# EAGLE design MESH-Grove (EAGLE 7.5.0)
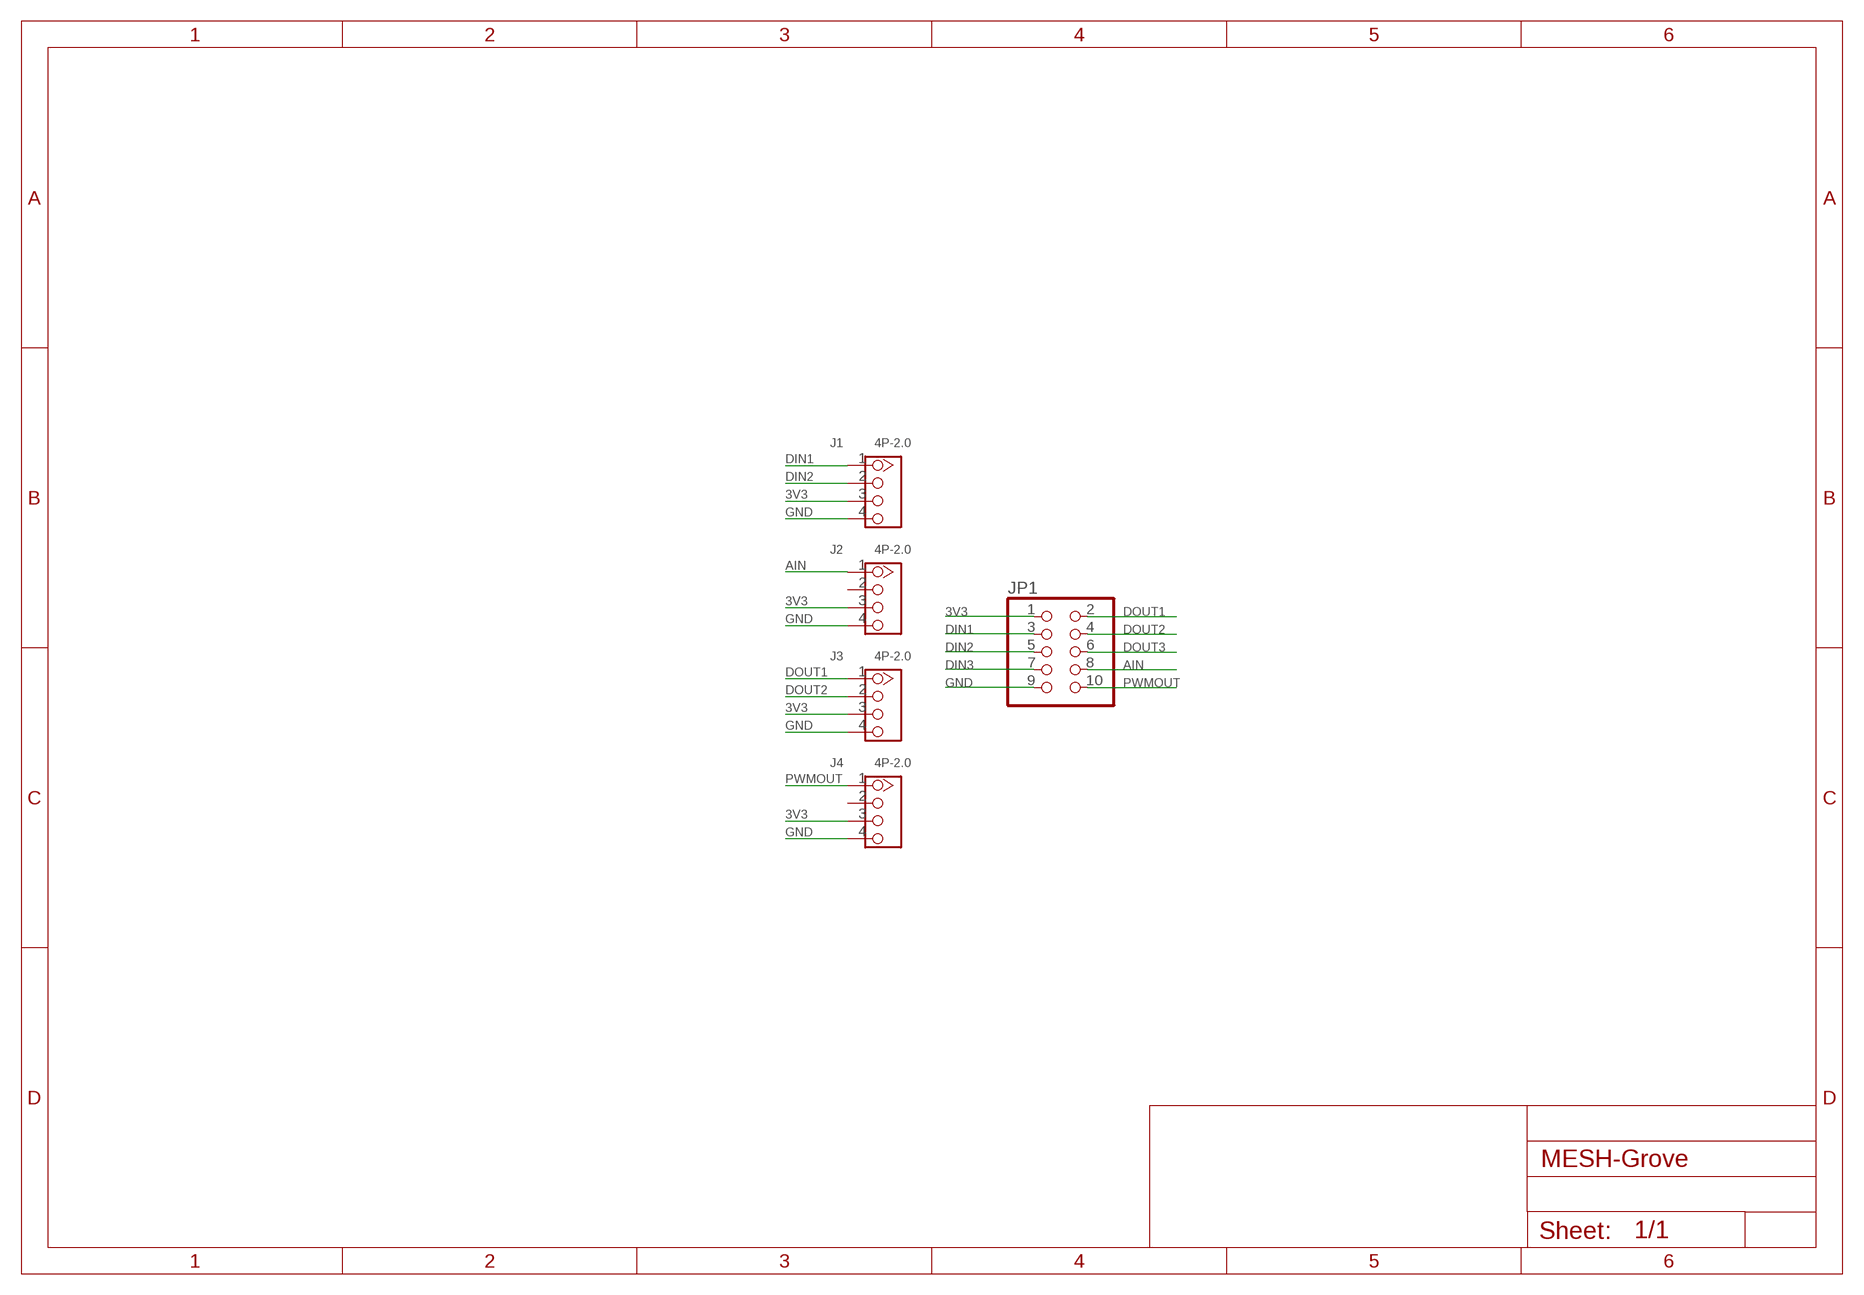
[diagram p0: schematic, sheet 1]

## Parts
J1  4P-2.0  GROVE-CONNECTOR-DIP(4P-2.0)  [HW4-2.0]
J2  4P-2.0  GROVE-CONNECTOR-DIP(4P-2.0)  [HW4-2.0]
J3  4P-2.0  GROVE-CONNECTOR-DIP(4P-2.0)  [HW4-2.0]
J4  4P-2.0  GROVE-CONNECTOR-DIP(4P-2.0)  [HW4-2.0]
JP1  PINHD-2X5  [2X05]

## Nets
3V3 [power]: J1.3 J2.3 J3.3 J4.3 JP1.1
AIN: J2.1 JP1.8
DIN1: J1.1 JP1.3
DIN2: J1.2 JP1.5
DIN3: JP1.7
DOUT1: J3.1 JP1.2
DOUT2: J3.2 JP1.4
DOUT3: JP1.6
GND [power]: J1.4 J2.4 J3.4 J4.4 JP1.9
PWMOUT: J4.1 JP1.10
Unconnected: J2.2 J4.2

## Library data of the parts
J1-J4 = Seeed-Connector -2016:GROVE-CONNECTOR-DIP(4P-2.0): 320110033
JP1 = pinhead:PINHD-2X5: PIN HEADER

## Net classes
1 power: width 0.813 mm

## Board
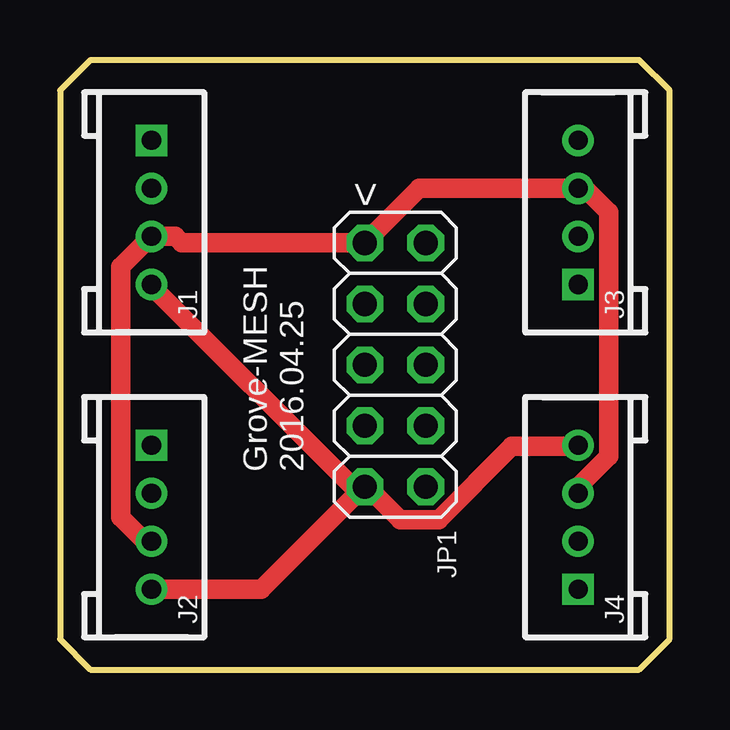
[diagram p1: board, top side]
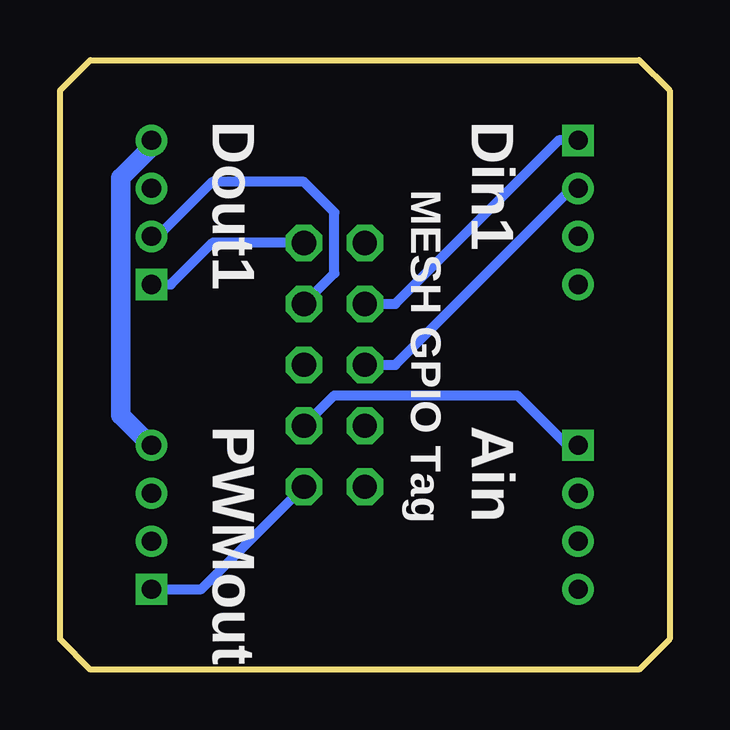
[diagram p2: board, bottom side, seen from below]

Size 25.4 x 25.4 mm. Coordinates in mm from the lower left corner, seen from the top.
Outline: 1.27,25.4 0,24.13 0,1.27 1.27,0 24.13,0 25.4,1.27 25.4,24.13 24.13,25.4 1.27,25.4
Copper layers (1*16): Top 0.035mm / dielectric 1.5mm / Bottom 0.035mm
Design rules "SeeedStudio_2layer_DRU_no_angle_20140221a": minimum track width 6mil, minimum drill 12mil, track to track 6mil, track to pad 6mil, pad to pad 6mil, via to via 6mil, smd to smd 0mil, copper to edge 10mil, drill to drill 10mil, minimum pad ring 10mil, minimum via ring 6mil, stop-mask expansion 2mil, vias tented up to drill 25mil, thermal gap 10mil

### Footprints (pad centres in the part's own frame; a part is rotated, then mirrored left to right if it is on the bottom)
HW4-2.0 = drill 0.8 pad 1.27 square: 1 -3,0 | drill 0.8 pad 1.27: 2 -1,0; 3 1,0; 4 3,0
2X05 = drill 1.016 octagon: 1 -5.08,-1.27; 2 -5.08,1.27; 3 -2.54,-1.27; 4 -2.54,1.27; 5 0,-1.27; 6 0,1.27; 7 2.54,-1.27; 8 2.54,1.27; 9 5.08,-1.27; 10 5.08,1.27

### Placement (x,y rotation side)
J1  3.81,19.05 270 top
J2  3.81,6.35 270 top
J3  21.59,19.05 90 top
J4  21.59,6.35 90 top
JP1  13.97,12.7 270 top

### Tracks (layer width: path | path; a pad name or v marks a point on that pad's centre or on a via)
3V3
  Top 0.813: J4.3 21.59,7.62 22.86,8.89 22.86,19.05 21.86,20.05 J3.3 14.97,20.05 JP1.1 5.08,17.78 4.81,18.05 J1.3 2.54,16.78 2.54,6.35 3.54,5.35 J2.3
AIN
  Bottom 0.406: JP1.8 13.97,11.43 6.35,11.43 4.27,9.35 J2.1
DIN1
  Bottom 0.406: JP1.3 11.43,15.24 4.62,22.05 J1.1
DIN2
  Bottom 0.406: JP1.5 11.43,12.7 4.08,20.05 J1.2
DOUT1
  Bottom 0.406: JP1.2 19.05,17.78 20.78,16.05 J3.1
DOUT2
  Bottom 0.406: JP1.4 13.97,16.51 13.97,19.05 15.24,20.32 19.05,20.32 21.32,18.05 J3.2
GND
  Top 0.813: J2.4 8.38,3.35 12.65,7.62 JP1.9 | J1.4 3.81,16 12.19,7.62 JP1.9 | J4.4 21.57,9.3 18.82,9.3 15.77,6.25 14.17,6.25 13.03,7.39 JP1.9
  Bottom 0.813: J3.4 21.64,22.02 21.64,21.72 22.86,20.5 22.86,10.59 21.64,9.37 J4.4
PWMOUT
  Bottom 0.406: JP1.10 19.51,3.35 J4.1

### Text on the board
tNames: < | Grove-MESH / 2016.04.25
bNames: Din1 | Dout1 | MESH GPIO Tag | Ain | PWMout